# Altium project jetson-nano-baseboard.PrjPcb
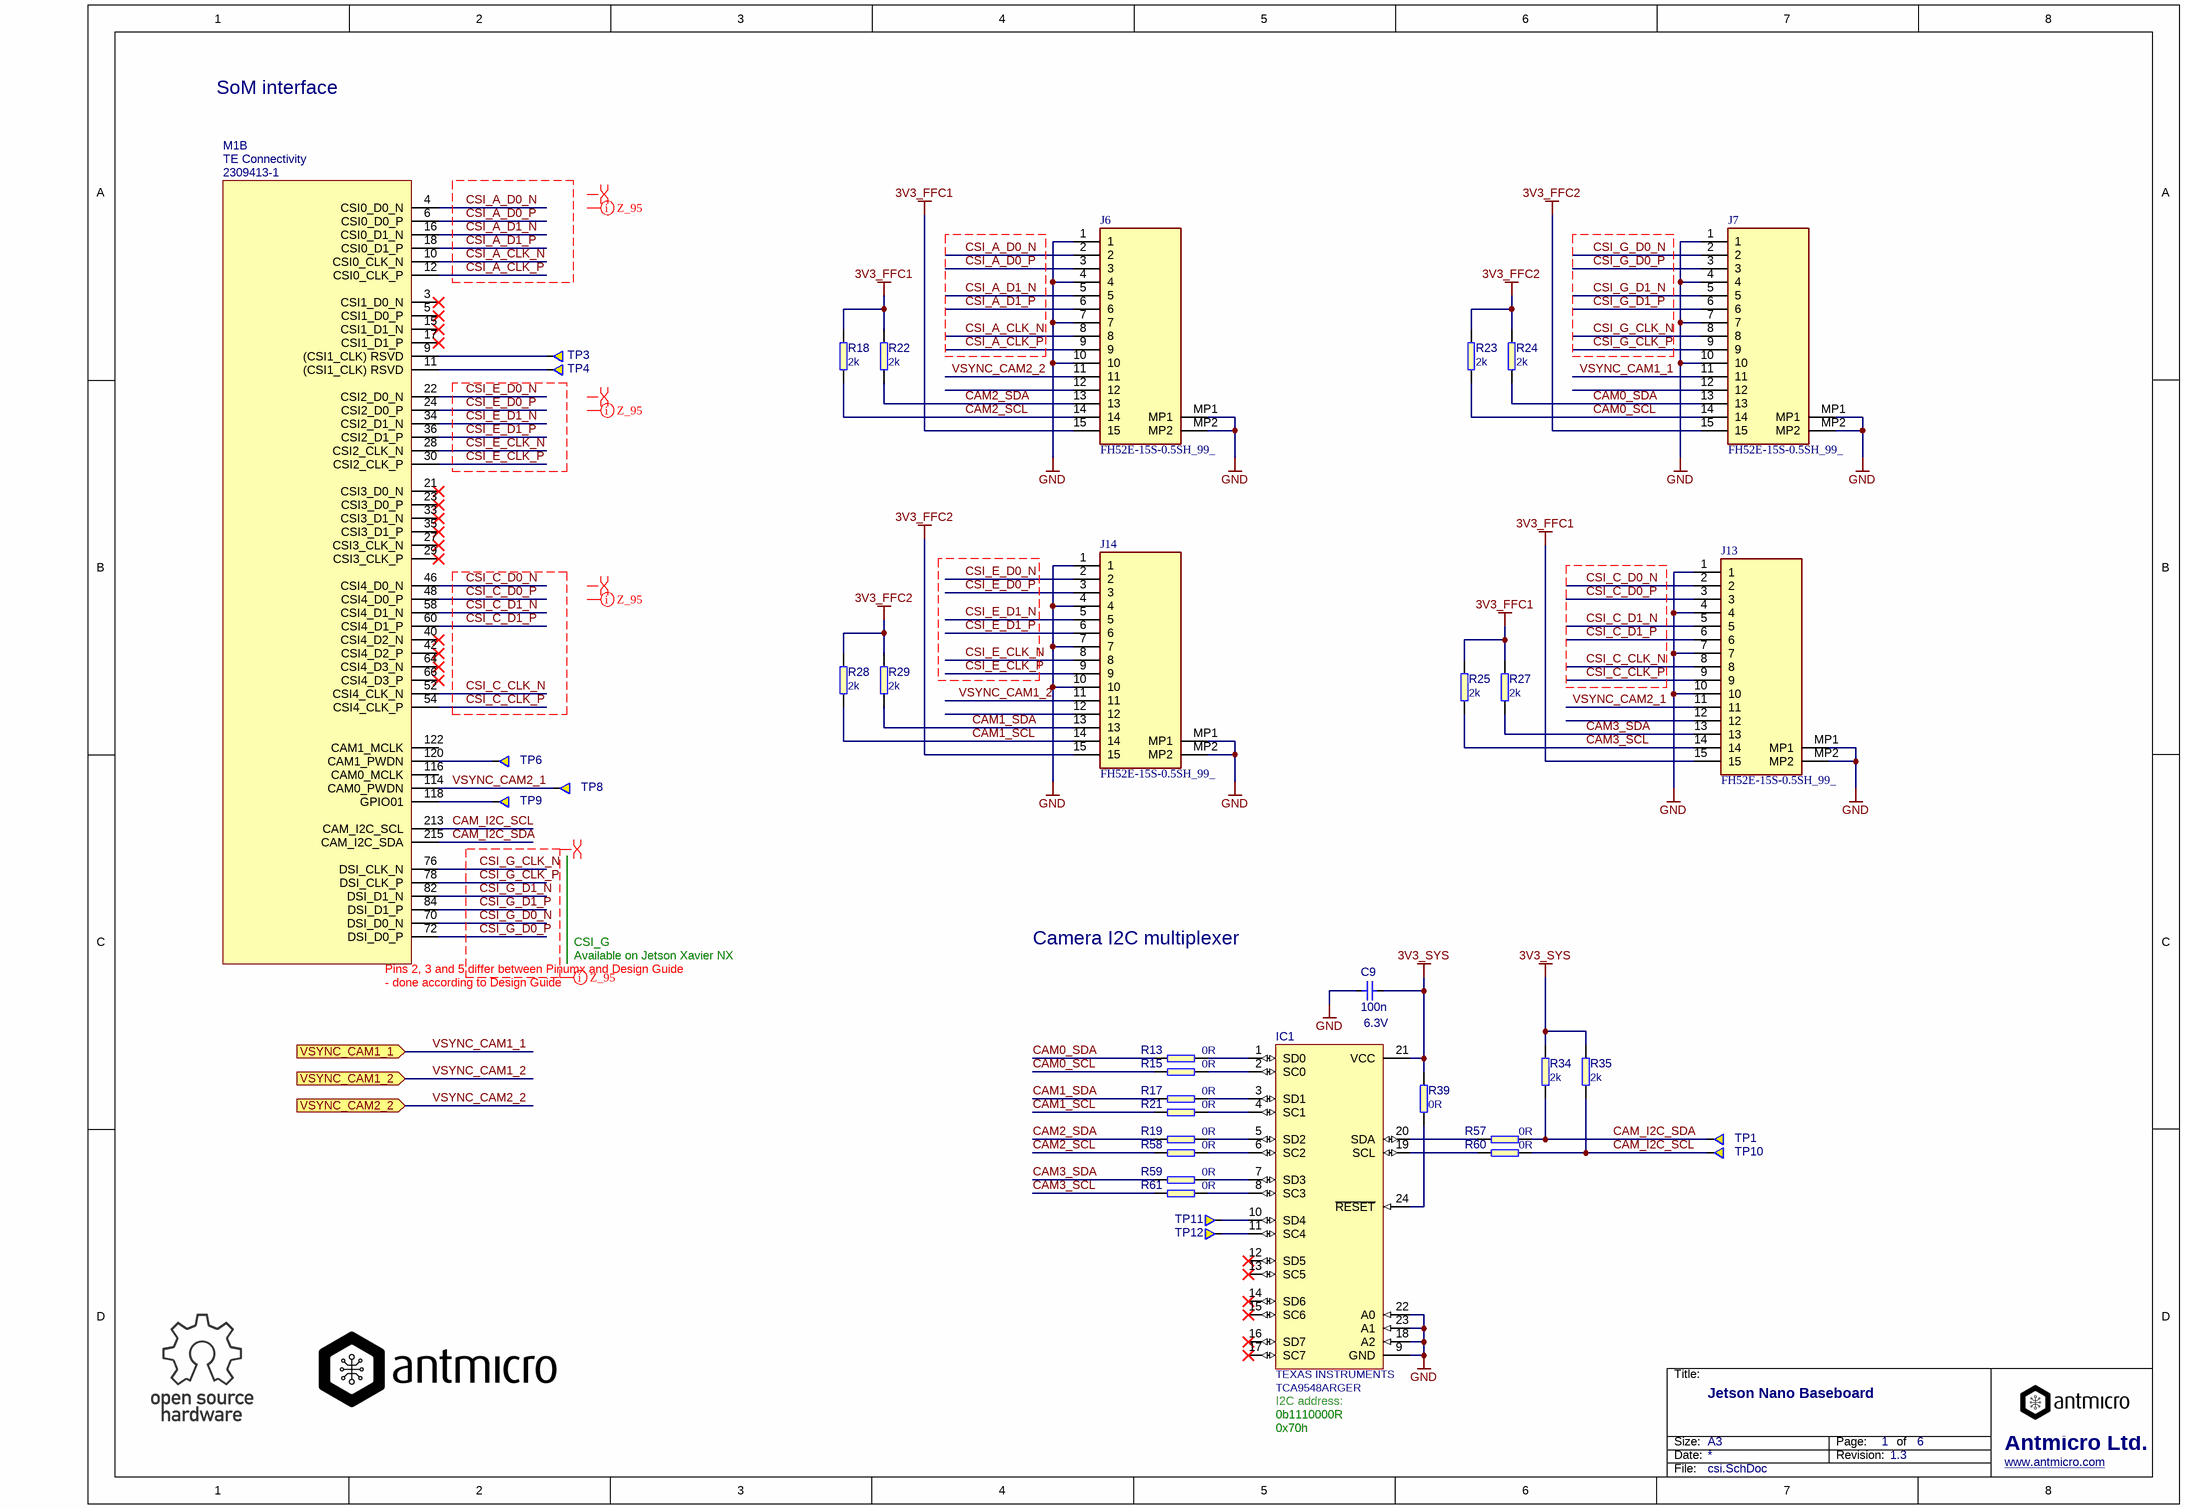
[diagram p0: csi.SchDoc]
AM_Revision: 1.3; AM_Status: OSHW; AM_Title: Jetson Nano Baseboard
3 sheets, 184 parts. Net scope: flat (ports and power ports of the same name join across sheets).
Board file: jetson-nano-0928-12.PcbDoc
Sheets:
  csi.SchDoc
  display.SchDoc
  supply.SchDoc

## Sheet csi.SchDoc
size A3; DocumentNumber: 1; SheetNumber: 1; SheetTotal: 6; PageSetup: Record=PageOptions|CenterHorizontal=True|CenterVertical=True|PrintScale=0.97|XCorrection=1.00|YCorrection=1.00|PrintKind=1|BorderSize=5000000|LeftOffset=0|BottomOffset=0|Orientation=2|PaperLength=2970|PaperWidth=2100|Scale=100|PaperSource=7|PrintQuality=600|MediaType=1|DitherType=10|PaperKind=A4|PrintScaleMode=1

### Parts
(Parts that share a designator on the sheet are numbered #1, #2 ... from top to bottom, then left to right.)
C9  Voltage: 6.3V  [0402]  (hidden comment: 100n)
IC1  TCA9548ARGER  Manufacturer: TEXAS INSTRUMENTS  [VQFN-24]
J6  FH52E-15S-0.5SH_99_  [FH52E15S05SH99]
J7  FH52E-15S-0.5SH_99_  [FH52E15S05SH99]
J13  FH52E-15S-0.5SH_99_  [FH52E15S05SH99]
J14  FH52E-15S-0.5SH_99_  [FH52E15S05SH99]
M1#1  Manufacturer: TE Connectivity  [jetson-nano-connector]  (hidden comment: 2309413-1)  (part B of 7)
R13  0R  [0402]
R15  0R  [0402]
R17  0R  [0402]
R18  2k  [0402]
R19  0R  [0402]
R21  0R  [0402]
R22  2k  [0402]
R23  2k  [0402]
R24  2k  [0402]
R25  2k  [0402]
R27  2k  [0402]
R28  2k  [0402]
R29  2k  [0402]
R34  2k  [0402]
R35  2k  [0402]
R39  0R  [0402]
R57  0R  [0402]
R58  0R  [0402]
R59  0R  [0402]
R60  0R  [0402]
R61  0R  [0402]
TP1  Testpad  [TP-R-1.5]  (value not drawn)  (no BOM)
TP3  Testpad  [TP-R-1.5]  (value not drawn)  (no BOM)
TP4  Testpad  [TP-R-1.5]  (value not drawn)  (no BOM)
TP6  Testpad  [TP-R-1.5]  (value not drawn)  (no BOM)
TP8  Testpad  [TP-R-1.5]  (value not drawn)  (no BOM)
TP9  Testpad  [TP-R-1.5]  (value not drawn)  (no BOM)
TP10  Testpad  [TP-R-1.5]  (value not drawn)  (no BOM)
TP11  Testpad  [TP-R-1.5]  (value not drawn)  (no BOM)
TP12  Testpad  [TP-R-1.5]  (value not drawn)  (no BOM)

### Ports
VSYNC_CAM1_1 (in), VSYNC_CAM1_2 (in), VSYNC_CAM2_2 (in)

### Nets
3V3_FFC1: J6.15 J13.15 R18.1 R22.1 R25.1 R27.1
3V3_FFC2: J7.15 J14.15 R23.1 R24.1 R28.1 R29.1
3V3_SYS: C9.2 IC1.21(VCC) R34.1 R35.1 R39.2
GND: C9.1 IC1.9(GND) IC1.18(A2) IC1.22(A0) IC1.23(A1) J6.1 J6.4 J6.7 J6.10 J6.MP1 J6.MP2 J7.1 J7.4 J7.7 J7.10 J7.MP1 J7.MP2 J13.1 J13.4 J13.7 J13.10 J13.MP1 J13.MP2 J14.1 J14.4 J14.7 J14.10 J14.MP1 J14.MP2
CAM0_SCL: J7.14 R15.1 R23.2
CAM0_SDA: J7.13 R13.1 R24.2
CAM1_SCL: J14.14 R21.1 R28.2
CAM1_SDA: J14.13 R17.1 R29.2
CAM2_SCL: J6.14 R18.2 R58.1
CAM2_SDA: J6.13 R19.1 R22.2
CAM3_SCL: J13.14 R25.2 R61.1
CAM3_SDA: J13.13 R27.2 R59.1
CAM_I2C_SCL: M1#1.213(CAM_I2C_SCL) R35.2 R60.2 TP10.1
CAM_I2C_SDA: M1#1.215(CAM_I2C_SDA) R34.2 R57.2 TP1.1
CSI_A_CLK_N: J6.8 M1#1.10(CSI0_CLK_N)
CSI_A_CLK_P: J6.9 M1#1.12(CSI0_CLK_P)
CSI_A_D0_N: J6.2 M1#1.4(CSI0_D0_N)
CSI_A_D0_P: J6.3 M1#1.6(CSI0_D0_P)
CSI_A_D1_N: J6.5 M1#1.16(CSI0_D1_N)
CSI_A_D1_P: J6.6 M1#1.18(CSI0_D1_P)
CSI_C_CLK_N: J13.8 M1#1.52(CSI4_CLK_N)
CSI_C_CLK_P: J13.9 M1#1.54(CSI4_CLK_P)
CSI_C_D0_N: J13.2 M1#1.46(CSI4_D0_N)
CSI_C_D0_P: J13.3 M1#1.48(CSI4_D0_P)
CSI_C_D1_N: J13.5 M1#1.58(CSI4_D1_N)
CSI_C_D1_P: J13.6 M1#1.60(CSI4_D1_P)
CSI_E_CLK_N: J14.8 M1#1.28(CSI2_CLK_N)
CSI_E_CLK_P: J14.9 M1#1.30(CSI2_CLK_P)
CSI_E_D0_N: J14.2 M1#1.22(CSI2_D0_N)
CSI_E_D0_P: J14.3 M1#1.24(CSI2_D0_P)
CSI_E_D1_N: J14.5 M1#1.34(CSI2_D1_N)
CSI_E_D1_P: J14.6 M1#1.36(CSI2_D1_P)
CSI_G_CLK_N: J7.8 M1#1.76(DSI_CLK_N)
CSI_G_CLK_P: J7.9 M1#1.78(DSI_CLK_P)
CSI_G_D0_N: J7.2 M1#1.70(DSI_D0_N)
CSI_G_D0_P: J7.3 M1#1.72(DSI_D0_P)
CSI_G_D1_N: J7.5 M1#1.82(DSI_D1_N)
CSI_G_D1_P: J7.6 M1#1.84(DSI_D1_P)
VSYNC_CAM1_1: J7.11 ; port VSYNC_CAM1_1
VSYNC_CAM1_2: J14.11 ; port VSYNC_CAM1_2
VSYNC_CAM2_1: J13.11 M1#1.114(CAM0_PWDN) TP8.1
VSYNC_CAM2_2: J6.11 ; port VSYNC_CAM2_2
NetIC1_1: IC1.1(SD0) R13.2
NetIC1_2: IC1.2(SC0) R15.2
NetIC1_3: IC1.3(SD1) R17.2
NetIC1_4: IC1.4(SC1) R21.2
NetIC1_5: IC1.5(SD2) R19.2
NetIC1_6: IC1.6(SC2) R58.2
NetIC1_7: IC1.7(SD3) R59.2
NetIC1_8: IC1.8(SC3) R61.2
NetIC1_10: IC1.10(SD4) TP11.1
NetIC1_11: IC1.11(SC4) TP12.1
NetIC1_19: IC1.19(SCL) R60.1
NetIC1_20: IC1.20(SDA) R57.1
NetIC1_24: IC1.24(~{RESET}) R39.1
NetM1#1_9: M1#1.9((CSI1_CLK)_RSVD) TP3.1
NetM1#1_11: M1#1.11((CSI1_CLK)_RSVD) TP4.1
NetM1#1_118: M1#1.118(GPIO01) TP9.1
NetM1#1_120: M1#1.120(CAM1_PWDN) TP6.1

Not connected (* = marked no-connect by the designer): IC1 12(SD5)* 13(SC5)* 14(SD6)* 15(SC6)* 16(SD7)* 17(SC7)*; J6 12; J7 12; J13 12; J14 12; M1#1 3(CSI1_D0_N)* 5(CSI1_D0_P)* 15(CSI1_D1_N)* 17(CSI1_D1_P)* 21(CSI3_D0_N)* 23(CSI3_D0_P)* 27(CSI3_CLK_N)* 29(CSI3_CLK_P)* 33(CSI3_D1_N)* 35(CSI3_D1_P)* 40(CSI4_D2_N)* 42(CSI4_D2_P)* 64(CSI4_D3_N)* 66(CSI4_D3_P)* 116(CAM0_MCLK) 122(CAM1_MCLK)

### Layout directives
differential pair: (no net found under the mark), CSI_G_CLK_N, CSI_G_CLK_P, CSI_G_D0_N, CSI_G_D0_P, CSI_G_D1_N, CSI_G_D1_P
net class Z_95: (no net found under the mark), CSI_G_CLK_N, CSI_G_CLK_P, CSI_G_D0_N, CSI_G_D0_P, CSI_G_D1_N, CSI_G_D1_P

### Notes on the sheet
- SoM interface
- CSI_G
- Available on Jetson Xavier NX
- Camera I2C multiplexer
- 0x70h
- 0b1110000R
- (near IC1) I2C address:
- Title:
- Size:
- Date:
- A3
- Revision:
- Page:
- of
- Antmicro Ltd.
- File:
- www.antmicro.com
- (in symbol jetson-nano-new-release, part B) Pins 2, 3 and 5 differ between Pinumx and Design Guide; - done according to Design Guide

### Library data of the parts
C9 = C_100n_0402: MLCC SMT Capacitor 100n 0402; Manufacturer: TDK; PartSymbol: C1005X5R0J104K050BA; Value: 100n; PartNumber: C_100n_0402
IC1 = TCA9548A: TCA9548ARGER  I2C SWITCH W/ RESET, 8-CH, VQFN-24; Value: TCA9548ARGER; PartNumber: TCA9548ARGER; PartSymbol: TCA9548ARGER
J6 J7 J13 J14 = FH52E-15S-0.5SH_99_: Connector; Manufacturer_Name: Hirose; Manufacturer_Part_Number: FH52E-15S-0.5SH(99); Description: FFC & FPC Connectors 0.5MM 15P LNG MTL FITNG SMT VERT MNT; Datasheet Link: https://componentsearchengine.com/Datasheets/1/FH52E-15S-0.5SH(99).pdf; Height: 2.2mm
M1#1 = jetson-nano-new-release: PartNumber: 2309413-1; PartSymbol: 2309413-1; Value: 2309413-1
R13 R15 R17 R19 R21 R39 R57-R61 = R_0R_0402: RES, 0R, 0402; Manufacturer: Panasonic; PartSymbol: ERJ2GE0R00X; Value: 0R; PartNumber: R_0R_0402
R18 R22-R25 R27-R29 R34 R35 = R_2k_0402: RES, 2k, 0402; Manufacturer: VISHAY; PartSymbol: CRCW04022K00FKED; PartNumber: R_2k_0402; Value: 2k
TP1 TP3 TP4 TP6 TP8-TP12 = Testpad: Testpad, round, 1.5mm; PartNumber: TP-R-1.5

## Sheet display.SchDoc
size A3; DocumentNumber: 2; SheetNumber: 2; SheetTotal: 6; PageSetup: Record=PageOptions|CenterHorizontal=True|CenterVertical=True|PrintScale=0.97|XCorrection=1.00|YCorrection=1.00|PrintKind=1|BorderSize=5000000|LeftOffset=0|BottomOffset=0|Orientation=2|PaperLength=2970|PaperWidth=2100|Scale=100|PaperSource=7|PrintQuality=600|MediaType=1|DitherType=10|PaperKind=A4|PrintScaleMode=1
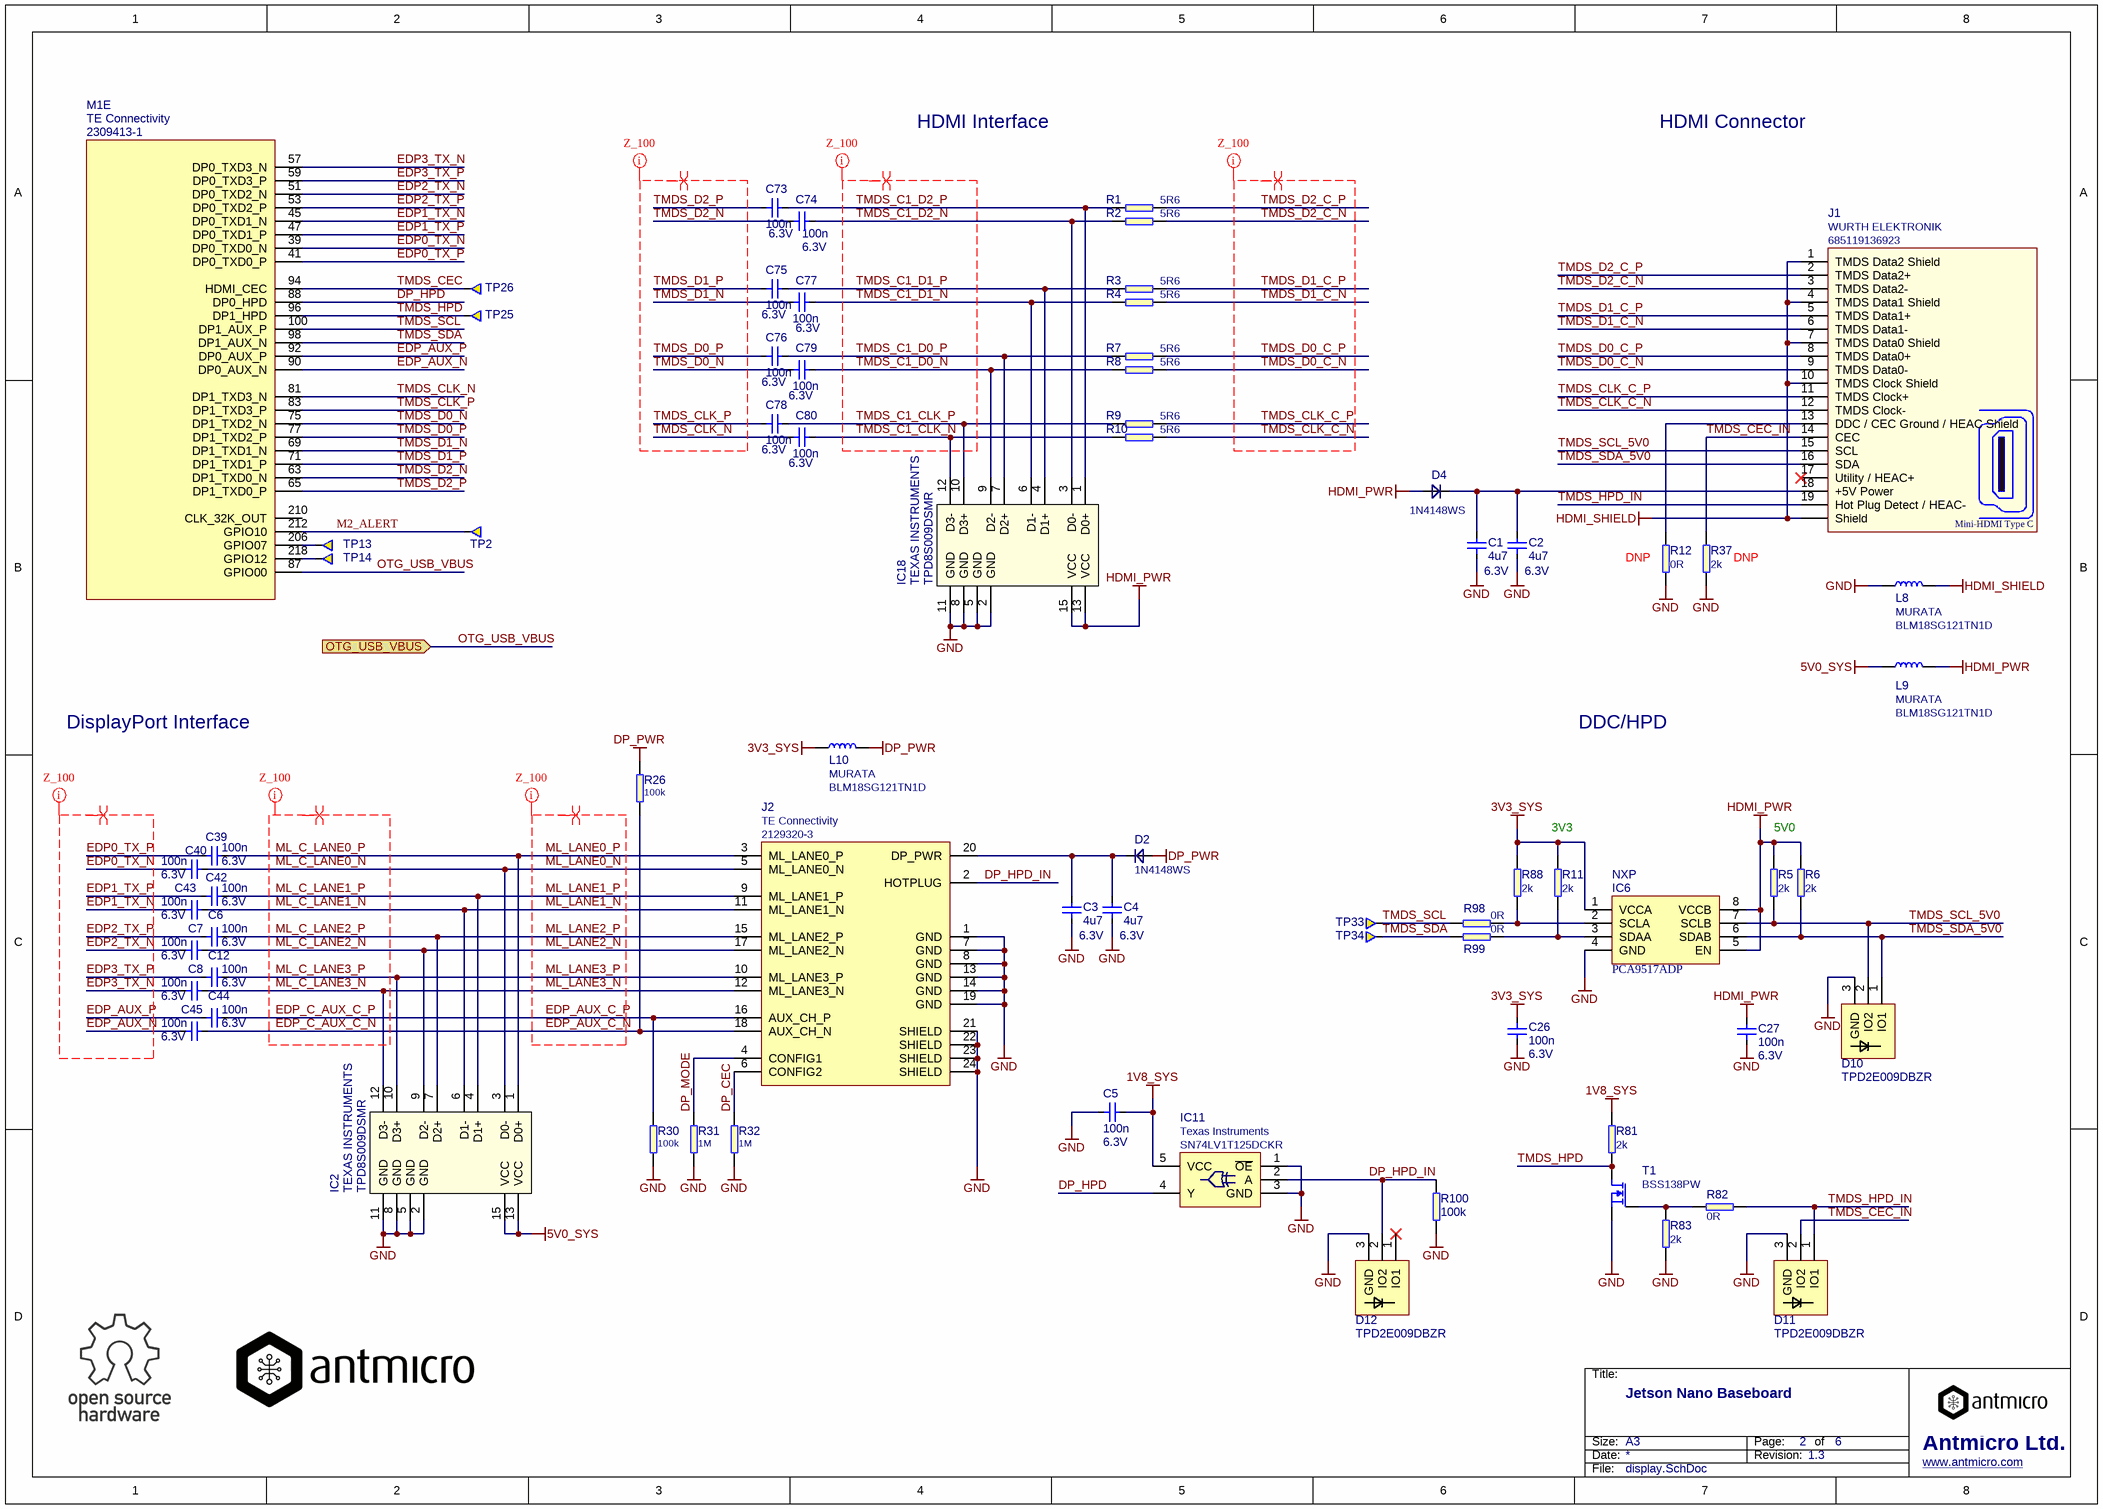
[diagram p1: display.SchDoc]

### Parts
(Parts that share a designator on the sheet are numbered #1, #2 ... from top to bottom, then left to right.)
C1  Voltage: 6.3V  [0402]  (hidden comment: 4u7)
C2  Voltage: 6.3V  [0402]  (hidden comment: 4u7)
C3  Voltage: 6.3V  [0402]  (hidden comment: 4u7)
C4  Voltage: 6.3V  [0402]  (hidden comment: 4u7)
C5  Voltage: 6.3V  [0402]  (hidden comment: 100n)
C6  Voltage: 6.3V  [0402]  (hidden comment: 100n)
C7  Voltage: 6.3V  [0402]  (hidden comment: 100n)
C8  Voltage: 6.3V  [0402]  (hidden comment: 100n)
C12  Voltage: 6.3V  [0402]  (hidden comment: 100n)
C26  Voltage: 6.3V  [0402]  (hidden comment: 100n)
C27  Voltage: 6.3V  [0402]  (hidden comment: 100n)
C39  Voltage: 6.3V  [0402]  (hidden comment: 100n)
C40  Voltage: 6.3V  [0402]  (hidden comment: 100n)
C42  Voltage: 6.3V  [0402]  (hidden comment: 100n)
C43  Voltage: 6.3V  [0402]  (hidden comment: 100n)
C44  Voltage: 6.3V  [0402]  (hidden comment: 100n)
C45  Voltage: 6.3V  [0402]  (hidden comment: 100n)
C73  Voltage: 6.3V  [0402]  (hidden comment: 100n)
C74  Voltage: 6.3V  [0402]  (hidden comment: 100n)
C75  Voltage: 6.3V  [0402]  (hidden comment: 100n)
C76  Voltage: 6.3V  [0402]  (hidden comment: 100n)
C77  Voltage: 6.3V  [0402]  (hidden comment: 100n)
C78  Voltage: 6.3V  [0402]  (hidden comment: 100n)
C79  Voltage: 6.3V  [0402]  (hidden comment: 100n)
C80  Voltage: 6.3V  [0402]  (hidden comment: 100n)
D2  1N4148WS  [SOD-323]
D4  1N4148WS  [SOD-323]
D10  TPD2E009DBZR  [SOT-23s]
D11  TPD2E009DBZR  [SOT-23s]
D12  TPD2E009DBZR  [SOT-23s]
IC2  Manufacturer: TEXAS INSTRUMENTS  PartSymbol: TPD8S009DSMR  [SON-15]  (hidden comment: TPD8S009)
IC6  PCA9517ADP  [MSOP-8]
IC11  SN74LV1T125DCKR  Manufacturer: Texas Instruments  [SC70-5]
IC18  Manufacturer: TEXAS INSTRUMENTS  PartSymbol: TPD8S009DSMR  [SON-15]  (hidden comment: TPD8S009)
J1  685119136923  Manufacturer: WURTH ELEKTRONIK  [WE_685119136923]
J2  2129320-3  Manufacturer: TE Connectivity  [2129320-3]
L8  BLM18SG121TN1D  Manufacturer: MURATA  [0603]
L9  BLM18SG121TN1D  Manufacturer: MURATA  [0603]
L10  BLM18SG121TN1D  Manufacturer: MURATA  [0603]
M1#2  Manufacturer: TE Connectivity  [jetson-nano-connector]  (hidden comment: 2309413-1)  (part E of 7)
R1  5R6  [0402]
R2  5R6  [0402]
R3  5R6  [0402]
R4  5R6  [0402]
R5  2k  [0402]
R6  2k  [0402]
R7  5R6  [0402]
R8  5R6  [0402]
R9  5R6  [0402]
R10  5R6  [0402]
R11  2k  [0402]
R12  0R  [0402]
R26  100k  [0402]
R30  100k  [0402]
R31  1M  [0402]
R32  1M  [0402]
R37  2k  [0402]
R81  2k  [0402]
R82  0R  [0402]
R83  2k  [0402]
R88  2k  [0402]
R98  0R  [0402]
R99  0R  [0402]
R100  100k  [0402]
T1  BSS138PW  [SC70-3]
TP2  Testpad  [TP-R-1.5]  (value not drawn)  (no BOM)
TP13  Testpad  [TP-R-1.5]  (value not drawn)  (no BOM)
TP14  Testpad  [TP-R-1.5]  (value not drawn)  (no BOM)
TP25  Testpad  [TP-R-1.5]  (value not drawn)  (no BOM)
TP26  Testpad  [TP-R-1.5]  (value not drawn)  (no BOM)
TP33  Testpad  [TP-R-1.5]  (value not drawn)  (no BOM)
TP34  Testpad  [TP-R-1.5]  (value not drawn)  (no BOM)

### Ports
OTG_USB_VBUS (in)

### Nets
1V8_SYS: C5.2 IC11.5(VCC) R81.1
3V3_SYS: C26.1 IC6.1(VCCA) L10.1 R11.1 R88.1
5V0_SYS: IC2.13(VCC) IC2.15(VCC) L9.1
DP_PWR: D2.A L10.2 R26.2
GND: C1.1 C2.1 C3.1 C4.1 C5.1 C26.2 C27.1 D10.3(GND) D11.3(GND) D12.3(GND) IC2.2(GND) IC2.5(GND) IC2.8(GND) IC2.11(GND) IC6.4(GND) IC11.1(~{OE}) IC11.3(GND) IC18.2(GND) IC18.5(GND) IC18.8(GND) IC18.11(GND) J2.1(GND) J2.7(GND) J2.8(GND) J2.13(GND) J2.14(GND) J2.19(GND) J2.21(SHIELD) J2.22(SHIELD) J2.23(SHIELD) J2.24(SHIELD) L8.1 R12.1 R30.1 R31.1 R32.1 R37.2 R83.2 R100.1 T1.2(S)
HDMI_PWR: C27.2 D4.A IC6.5(EN) IC6.8(VCCB) IC18.13(VCC) IC18.15(VCC) L9.2 R5.1 R6.1
HDMI_SHIELD: J1.1(TMDS_Data2_Shield) J1.4(TMDS_Data1_Shield) J1.7(TMDS_Data0_Shield) J1.10(TMDS_Clock_Shield) J1.Shell(Shield) L8.2
DP_CEC: J2.6(CONFIG2) R32.2
DP_HPD: IC11.4(Y) M1#2.88(DP0_HPD)
DP_HPD_IN: D12.2(IO2) IC11.2(A) J2.2(HOTPLUG) R100.2
DP_MODE: J2.4(CONFIG1) R31.2
EDP0_TX_N: C40.1 M1#2.39(DP0_TXD0_N)
EDP0_TX_P: C39.1 M1#2.41(DP0_TXD0_P)
EDP1_TX_N: C43.1 M1#2.45(DP0_TXD1_N)
EDP1_TX_P: C42.1 M1#2.47(DP0_TXD1_P)
EDP2_TX_N: C7.1 M1#2.51(DP0_TXD2_N)
EDP2_TX_P: C6.1 M1#2.53(DP0_TXD2_P)
EDP3_TX_N: C12.1 M1#2.57(DP0_TXD3_N)
EDP3_TX_P: C8.1 M1#2.59(DP0_TXD3_P)
EDP_AUX_C_N: C45.2 J2.18(AUX_CH_N) R26.1  [also labelled EDP_C_AUX_C_N]
EDP_AUX_C_P: C44.2 J2.16(AUX_CH_P) R30.2  [also labelled EDP_C_AUX_C_P]
EDP_AUX_N: C45.1 M1#2.90(DP0_AUX_N)
EDP_AUX_P: C44.1 M1#2.92(DP0_AUX_P)
M2_ALERT: M1#2.212(GPIO10) TP2.1
ML_C_LANE0_N: C40.2 IC2.3(D0-) J2.5(ML_LANE0_N)  [also labelled ML_LANE0_N]
ML_C_LANE0_P: C39.2 IC2.1(D0+) J2.3(ML_LANE0_P)  [also labelled ML_LANE0_P]
ML_C_LANE1_N: C43.2 IC2.6(D1-) J2.11(ML_LANE1_N)  [also labelled ML_LANE1_N]
ML_C_LANE1_P: C42.2 IC2.4(D1+) J2.9(ML_LANE1_P)  [also labelled ML_LANE1_P]
ML_C_LANE2_N: C7.2 IC2.9(D2-) J2.17(ML_LANE2_N)  [also labelled ML_LANE2_N]
ML_C_LANE2_P: C6.2 IC2.7(D2+) J2.15(ML_LANE2_P)  [also labelled ML_LANE2_P]
ML_C_LANE3_N: C12.2 IC2.12(D3-) J2.12(ML_LANE3_N)  [also labelled ML_LANE3_N]
ML_C_LANE3_P: C8.2 IC2.10(D3+) J2.10(ML_LANE3_P)  [also labelled ML_LANE3_P]
OTG_USB_VBUS: M1#2.87(GPIO00) ; port OTG_USB_VBUS
TMDS_C1_CLK_N: C80.2 IC18.12(D3-) R10.1
TMDS_C1_CLK_P: C78.2 IC18.10(D3+) R9.1
TMDS_C1_D0_N: C79.2 IC18.9(D2-) R8.1
TMDS_C1_D0_P: C76.2 IC18.7(D2+) R7.1
TMDS_C1_D1_N: C77.2 IC18.6(D1-) R4.1
TMDS_C1_D1_P: C75.2 IC18.4(D1+) R3.1
TMDS_C1_D2_N: C74.2 IC18.3(D0-) R2.1
TMDS_C1_D2_P: C73.2 IC18.1(D0+) R1.1
TMDS_CEC: M1#2.94(HDMI_CEC) TP26.1
TMDS_CEC_IN: D11.2(IO2) J1.14(CEC) R37.1
TMDS_CLK_C_N: J1.12(TMDS_Clock-) R10.2
TMDS_CLK_C_P: J1.11(TMDS_Clock+) R9.2
TMDS_CLK_N: C80.1 M1#2.81(DP1_TXD3_N)
TMDS_CLK_P: C78.1 M1#2.83(DP1_TXD3_P)
TMDS_D0_C_N: J1.9(TMDS_Data0-) R8.2
TMDS_D0_C_P: J1.8(TMDS_Data0+) R7.2
TMDS_D0_N: C79.1 M1#2.75(DP1_TXD2_N)
TMDS_D0_P: C76.1 M1#2.77(DP1_TXD2_P)
TMDS_D1_C_N: J1.6(TMDS_Data1-) R4.2
TMDS_D1_C_P: J1.5(TMDS_Data1+) R3.2
TMDS_D1_N: C77.1 M1#2.69(DP1_TXD1_N)
TMDS_D1_P: C75.1 M1#2.71(DP1_TXD1_P)
TMDS_D2_C_N: J1.3(TMDS_Data2-) R2.2
TMDS_D2_C_P: J1.2(TMDS_Data2+) R1.2
TMDS_D2_N: C74.1 M1#2.63(DP1_TXD0_N)
TMDS_D2_P: C73.1 M1#2.65(DP1_TXD0_P)
TMDS_HPD: M1#2.96(DP1_HPD) R81.2 T1.3(D) TP25.1
TMDS_HPD_IN: D11.1(IO1) J1.19(Hot_Plug_Detect_/_HEAC-) R82.1
TMDS_SCL: M1#2.100(DP1_AUX_P) R98.2 TP33.1
TMDS_SCL_5V0: D10.2(IO2) IC6.7(SCLB) J1.15(SCL) R5.2
TMDS_SDA: M1#2.98(DP1_AUX_N) R99.2 TP34.1
TMDS_SDA_5V0: D10.1(IO1) IC6.6(SDAB) J1.16(SDA) R6.2
NetC1_2: C1.2 C2.2 D4.C J1.18(+5V_Power)
NetC3_2: C3.2 C4.2 D2.C J2.20(DP_PWR)
NetIC6_2: IC6.2(SCLA) R88.2 R98.1
NetIC6_3: IC6.3(SDAA) R11.2 R99.1
NetJ1_13: J1.13(DDC_/_CEC_Ground_/_HEAC_Shield) R12.2
NetM1#2_206: M1#2.206(GPIO07) TP13.1
NetM1#2_218: M1#2.218(GPIO12) TP14.1
NetR82_2: R82.2 R83.1 T1.1(G)

Not connected (* = marked no-connect by the designer): D12 1(IO1)*; J1 17(Utility_/_HEAC+)*; M1#2 210(CLK_32K_OUT)

### Layout directives
differential pair: EDP0_TX_N, EDP0_TX_P, EDP1_TX_N, EDP1_TX_P, EDP2_TX_N, EDP2_TX_P, EDP3_TX_N, EDP3_TX_P, EDP_AUX_C_N, EDP_AUX_C_P, EDP_AUX_N, EDP_AUX_P, EDP_C_AUX_C_N, EDP_C_AUX_C_P, ML_C_LANE0_N, ML_C_LANE0_P, ML_C_LANE1_N, ML_C_LANE1_P, ML_C_LANE2_N, ML_C_LANE2_P, ML_C_LANE3_N, ML_C_LANE3_P, ML_LANE0_N, ML_LANE0_P, ML_LANE1_N, ML_LANE1_P, ML_LANE2_N, ML_LANE2_P, ML_LANE3_N, ML_LANE3_P, TMDS_C1_CLK_N, TMDS_C1_CLK_P, TMDS_C1_D0_N, TMDS_C1_D0_P, TMDS_C1_D1_N, TMDS_C1_D1_P, TMDS_C1_D2_N, TMDS_C1_D2_P, TMDS_CLK_C_N, TMDS_CLK_C_P, TMDS_CLK_N, TMDS_CLK_P, TMDS_D0_C_N, TMDS_D0_C_P, TMDS_D0_N, TMDS_D0_P, TMDS_D1_C_N, TMDS_D1_C_P, TMDS_D1_N, TMDS_D1_P, TMDS_D2_C_N, TMDS_D2_C_P, TMDS_D2_N, TMDS_D2_P
net class Z_100: EDP0_TX_N, EDP0_TX_P, EDP1_TX_N, EDP1_TX_P, EDP2_TX_N, EDP2_TX_P, EDP3_TX_N, EDP3_TX_P, EDP_AUX_C_N, EDP_AUX_C_P, EDP_AUX_N, EDP_AUX_P, EDP_C_AUX_C_N, EDP_C_AUX_C_P, ML_C_LANE0_N, ML_C_LANE0_P, ML_C_LANE1_N, ML_C_LANE1_P, ML_C_LANE2_N, ML_C_LANE2_P, ML_C_LANE3_N, ML_C_LANE3_P, ML_LANE0_N, ML_LANE0_P, ML_LANE1_N, ML_LANE1_P, ML_LANE2_N, ML_LANE2_P, ML_LANE3_N, ML_LANE3_P, TMDS_C1_CLK_N, TMDS_C1_CLK_P, TMDS_C1_D0_N, TMDS_C1_D0_P, TMDS_C1_D1_N, TMDS_C1_D1_P, TMDS_C1_D2_N, TMDS_C1_D2_P, TMDS_CLK_C_N, TMDS_CLK_C_P, TMDS_CLK_N, TMDS_CLK_P, TMDS_D0_C_N, TMDS_D0_C_P, TMDS_D0_N, TMDS_D0_P, TMDS_D1_C_N, TMDS_D1_C_P, TMDS_D1_N, TMDS_D1_P, TMDS_D2_C_N, TMDS_D2_C_P, TMDS_D2_N, TMDS_D2_P

### Notes on the sheet
- HDMI Interface
- HDMI Connector
- 1V8
- (near R12) DNP
- (near R37) DNP
- DisplayPort Interface
- DDC/HPD
- 3V3
- 5V0
- (near IC6) NXP
- Title:
- Size:
- Date:
- A3
- Revision:
- Page:
- of
- Antmicro Ltd.
- File:
- www.antmicro.com
- (in symbol WE_685119136923) Mini-HDMI Type C

### Library data of the parts
C1-C4 = C_4u7_0402: MLCC SMT Capacitor 4.7uF 0402; Manufacturer: MURATA; PartSymbol: GRM155R60J475ME87D; PartNumber: C_4u7_0402; Value: 4u7
C5-C8 C12 C26 C27 C39 C40 C42-C45 C73-C80 = C_100n_0402: as C9 on sheet csi; Value: 100n; PartNumber: C_100n_0402
D2 D4 = diode: Diode small signal; Manufacturer: ON SEMICONDUCTOR; Value: 1N4148WS; PartNumber: 1N4148WS; PartSymbol: 1N4148WS
D10-D12 = TPD2E009DBZR: DIODE, SCHOTTKY, 30V, 200MA, SOT-23; Manufacturer: NXP; PartNumber: TPD2E009DBZR; Value: TPD2E009DBZR; MPN: TPD2E009DBZR
IC2 IC18 = TPD8S009: 8-Channel ESD Protection for DisplayPort and HDMI; Value: TPD8S009; PartNumber: TPD8S009
IC6 = PCA9517ADP: IC REDRIVER I2C 1CH 8TSSOP; Manufacturer: NXP; Value: PCA9517ADP; PartNumber: PCA9517ADP; PartSymbol: PCA9517ADP
IC11 = SN74LV1T125: Buffer, 74LV1T125, 1.6 V to 5.5 V, SOT-23-5; PartNumber: SN74LV1T125DCKR; Value: SN74LV1T125DCKR; PartSymbol: SN74LV1T125DCKR
J1 = WE_685119136923: CONN HDMI FEMALE R/A 19POS 2.6MM; PartNumber: WE_685119136923; Value: 685119136923; PartSymbol: WE_685119136923
J2 = miniDP: Mini Displayport Reverse Offset; PartNumber: 2129320-3; Value: 2129320-3; PartSymbol: 2129320-3
L8-L10 = BLM18SG121TN1D: FERRITE BEAD, 0.025OHM, 3A, 0603; Value: BLM18SG121TN1D; PartNumber: BLM18SG121TN1D; PartSymbol: BLM18SG121TN1D
M1#2 = jetson-nano-new-release: PartNumber: 2309413-1; PartSymbol: 2309413-1; Value: 2309413-1
R1-R4 R7-R10 = R_5R6_0402: RES, 5R6, 0402; Manufacturer: Panasonic; PartSymbol: ERJ2GEJ5R6X; PartNumber: R_5R6_0402; Value: 5R6
R5 R6 R11 R37 R81 R83 R88 = R_2k_0402: as R18 on sheet csi; PartNumber: R_2k_0402; Value: 2k
R12 R82 R98 R99 = R_0R_0402: as R13 on sheet csi; PartNumber: R_0R_0402; Value: 0R
R26 R30 R100 = R_100k_0402: SMT Resistor 100k 0402; Manufacturer: VISHAY; PartSymbol: CRCW0402100KFKEDHP; Tolerance: 1%; PartNumber: R_100k_0402; Value: 100k
R31 R32 = R_1M_0402: SMT Resistor 1M 0402; Manufacturer: VISHAY; PartSymbol: CRCW04021M00FKED; Tolerance: 1%; PartNumber: R_1M_0402; Value: 1M
T1 = NMOS: MOSFET, N CH, 60V, 0.2A; Manufacturer: NXP; Value: BSS138PW; PartNumber: BSS138PW; PartSymbol: BSS138PW
TP2 TP13 TP14 TP25 TP26 TP33 TP34 = Testpad: Testpad, round, 1.5mm; PartNumber: TP-R-1.5

## Sheet supply.SchDoc
size A3; DocumentNumber: 5; SheetNumber: 5; SheetTotal: 6; PageSetup: Record=PageOptions|CenterHorizontal=True|CenterVertical=True|PrintScale=0.97|XCorrection=1.00|YCorrection=1.00|PrintKind=1|BorderSize=5000000|LeftOffset=0|BottomOffset=0|Orientation=2|PaperLength=2970|PaperWidth=2100|Scale=100|PaperSource=7|PrintQuality=600|MediaType=1|DitherType=10|PaperKind=A4|PrintScaleMode=1
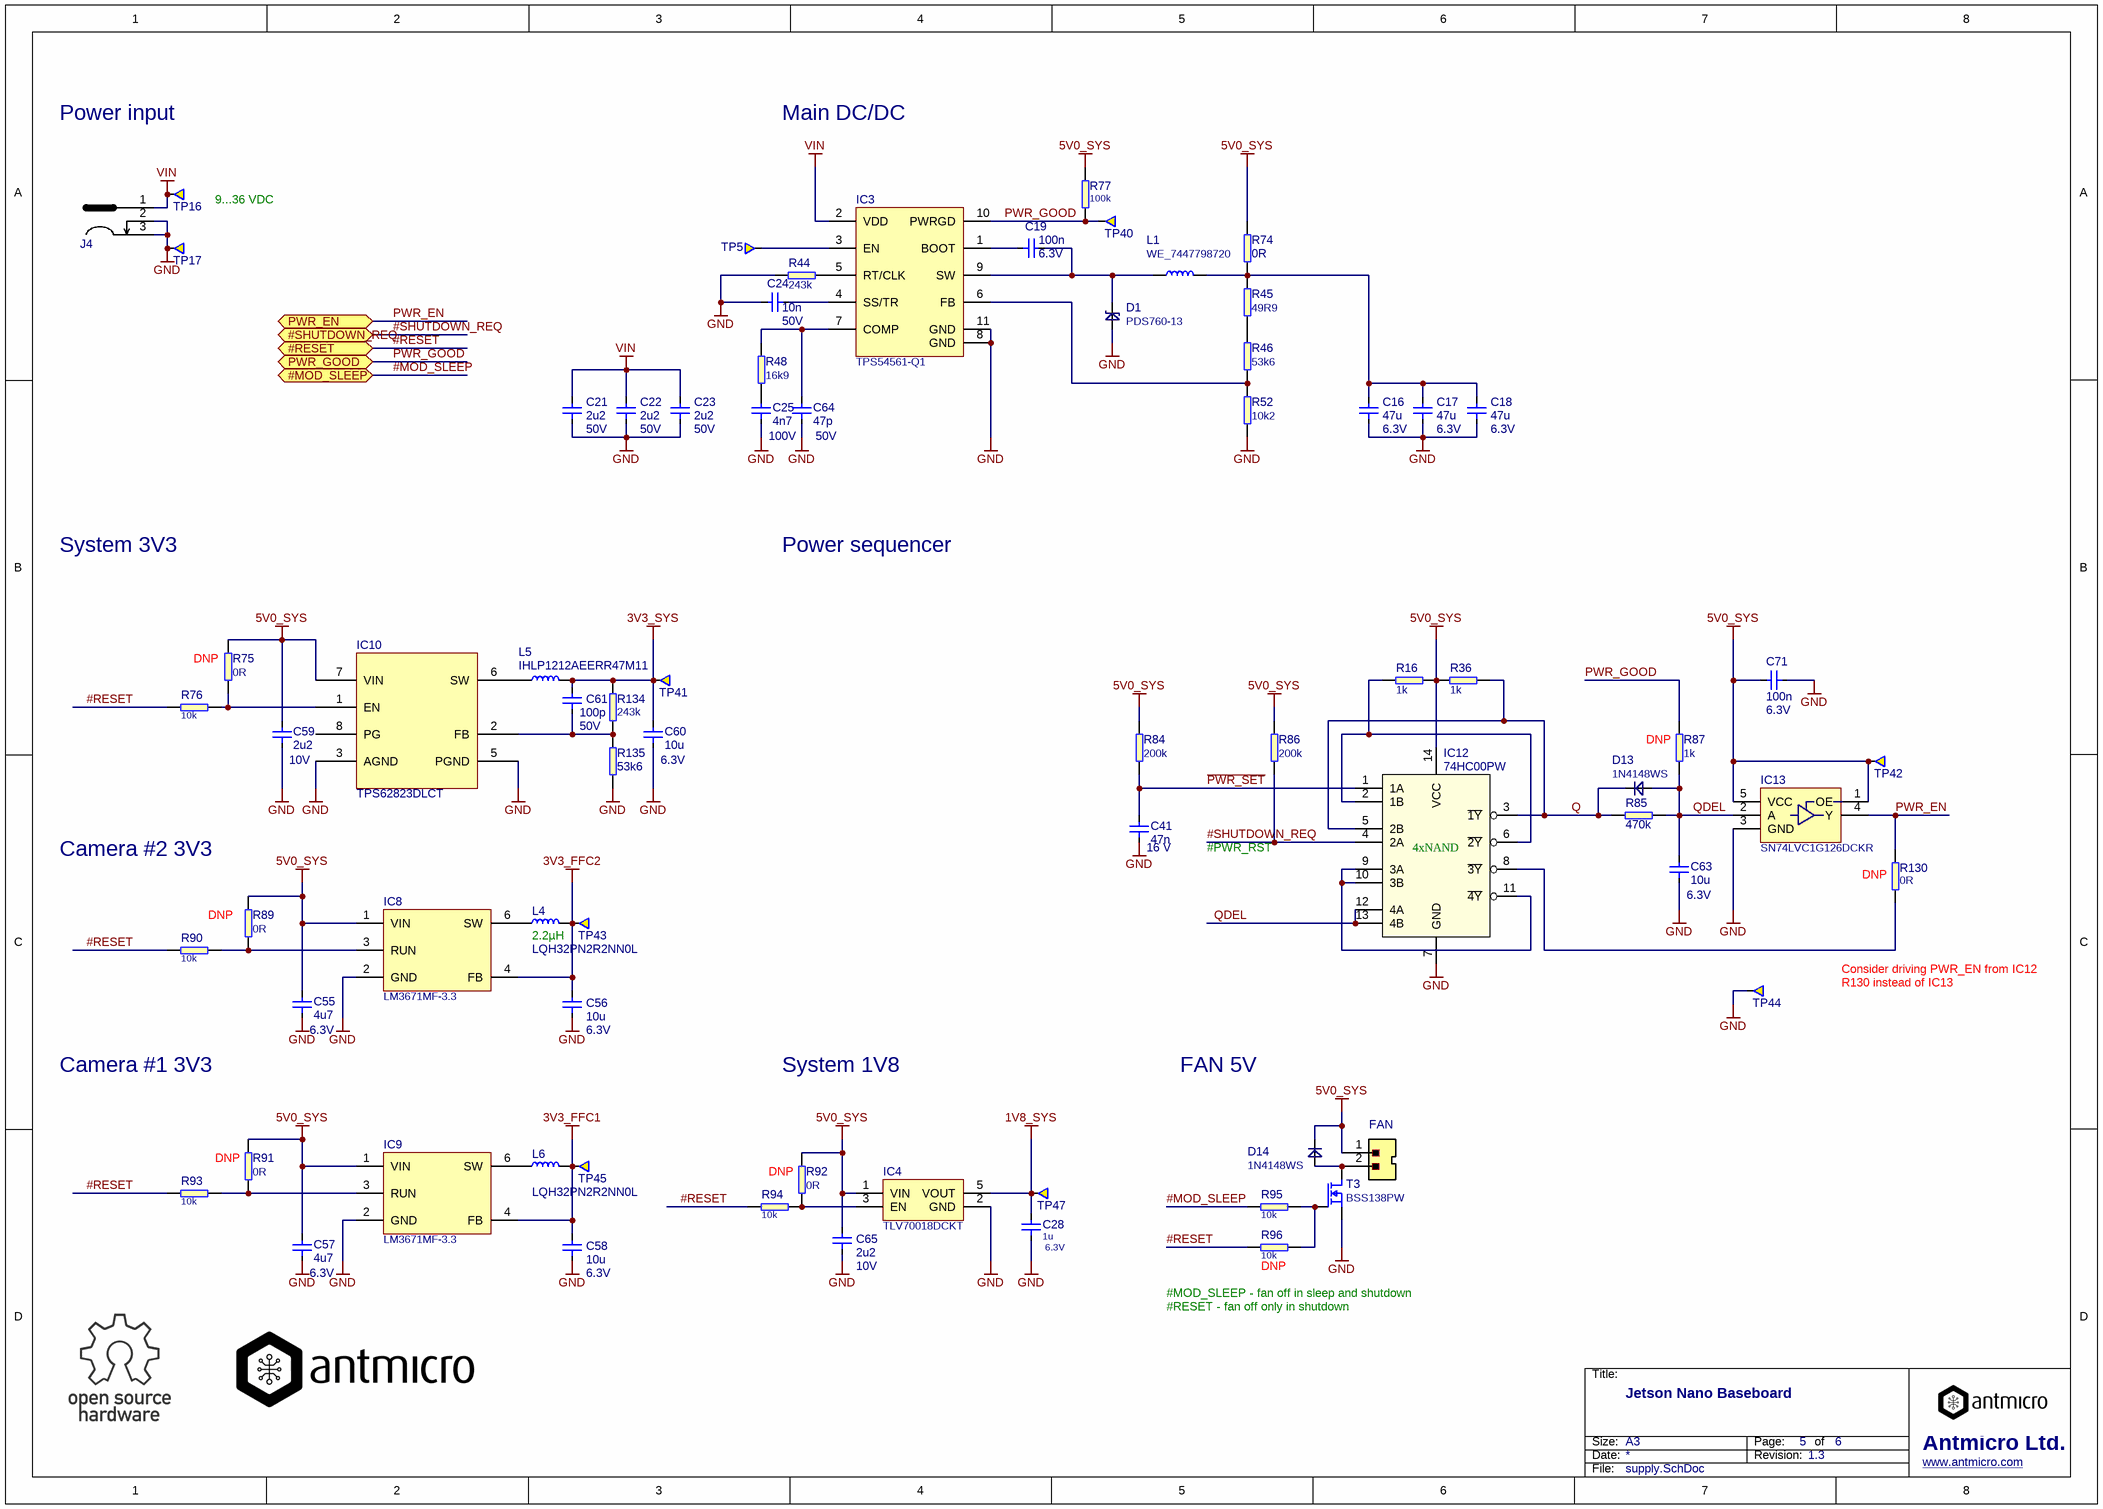
[diagram p2: supply.SchDoc]

### Parts
C16  Voltage: 6.3V  [0805]  (hidden comment: 47u)
C17  Voltage: 6.3V  [0805]  (hidden comment: 47u)
C18  Voltage: 6.3V  [0805]  (hidden comment: 47u)
C19  Voltage: 6.3V  [0402]  (hidden comment: 100n)
C21  Voltage: 50V  [1206]  (hidden comment: 2u2)
C22  Voltage: 50V  [1206]  (hidden comment: 2u2)
C23  Voltage: 50V  [1206]  (hidden comment: 2u2)
C24  Voltage: 50V  [0402]  (hidden comment: 10n)
C25  Voltage: 100V  [0402]  (hidden comment: 4n7)
C28  Voltage: 6.3V  [0402]  (hidden comment: 1u)
C41  Voltage: 16 V  [0402]  (hidden comment: 47n)
C55  Voltage: 6.3V  [0402]  (hidden comment: 4u7)
C56  Voltage: 6.3V  [0603]  (hidden comment: 10u)
C57  Voltage: 6.3V  [0402]  (hidden comment: 4u7)
C58  Voltage: 6.3V  [0603]  (hidden comment: 10u)
C59  Voltage: 10V  [0402]  (hidden comment: 2u2)
C60  Voltage: 6.3V  [0603]  (hidden comment: 10u)
C61  Voltage: 50V  [0402]  (hidden comment: 100p)
C63  Voltage: 6.3V  [0603]  (hidden comment: 10u)
C64  Voltage: 50V  [0402]  (hidden comment: 47p)
C65  Voltage: 10V  [0402]  (hidden comment: 2u2)
C71  Voltage: 6.3V  [0402]  (hidden comment: 100n)
D1  PDS760-13  [PowerDI]
D13  1N4148WS  [SOD-323]
D14  1N4148WS  [SOD-323]
FAN  MX-22-23-2021  [molex_2223-2021]  (value not drawn)
IC3  TPS54561-Q1  [WSON-10_4x4]
IC4  TLV70018DCKT  [SC70-5]
IC8  LM3671MF-3.3  [SOT23-5N]
IC9  LM3671MF-3.3  [SOT23-5N]
IC10  TPS62823DLCT  [TPS62823]
IC12  74HC00PW  [TSSOP-14]
IC13  SN74LVC1G126DCKR  [R-PDSO-G5]
J4  MJ-179PH  [DC_SOCKET]  (value not drawn)
L1  WE_7447798720  [WE_7447798720]
L4  LQH32PN2R2NN0L  [LQH32PN2R2NN0L]
L5  IHLP1212AEERR47M11  [IHLP-1212AE]
L6  LQH32PN2R2NN0L  [LQH32PN2R2NN0L]
R16  1k  [0402]
R36  1k  [0402]
R44  243k  [0402]
R45  49R9  [0402]
R46  53k6  [0402]
R48  16k9  [0402]
R52  10k2  [0402]
R74  0R  [0805]
R75  0R  [0402]
R76  10k  [0402]
R77  100k  [0402]
R84  200k  [0402]
R85  470k  [0402]
R86  200k  [0402]
R87  1k  [0402]
R89  0R  [0402]
R90  10k  [0402]
R91  0R  [0402]
R92  0R  [0402]
R93  10k  [0402]
R94  10k  [0402]
R95  10k  [0402]
R96  10k  [0402]
R130  0R  [0402]
R134  243k  [0402]
R135  53k6  [0402]
T3  BSS138PW  [SC70-3]
TP5  Testpad  [TP-R-1.5]  (value not drawn)  (no BOM)
TP16  Testpad  [TP-R-1.5]  (value not drawn)  (no BOM)
TP17  Testpad  [TP-R-1.5]  (value not drawn)  (no BOM)
TP40  Testpad  [TP-R-1.5]  (value not drawn)  (no BOM)
TP41  Testpad  [TP-R-1.5]  (value not drawn)  (no BOM)
TP42  Testpad  [TP-R-1.5]  (value not drawn)  (no BOM)
TP43  Testpad  [TP-R-1.5]  (value not drawn)  (no BOM)
TP44  Testpad  [TP-R-1.5]  (value not drawn)  (no BOM)
TP45  Testpad  [TP-R-1.5]  (value not drawn)  (no BOM)
TP47  Testpad  [TP-R-1.5]  (value not drawn)  (no BOM)

### Ports
#MOD_SLEEP, #RESET, #SHUTDOWN_REQ, PWR_EN, PWR_GOOD

### Nets
1V8_SYS: C28.2 IC4.5(VOUT) TP47.1
3V3_FFC1: C58.2 IC9.4(FB) L6.2 TP45.1
3V3_FFC2: C56.2 IC8.4(FB) L4.2 TP43.1
3V3_SYS: C60.2 C61.2 L5.2 R134.1 TP41.1
5V0_SYS: C55.2 C57.2 C59.2 C65.2 C71.2 D14.C FAN.1 IC4.1(VIN) IC8.1(VIN) IC9.1(VIN) IC10.7(VIN) IC12.14(VCC) IC13.1(OE) IC13.5(VCC) R16.1 R36.2 R74.2 R75.2 R77.2 R84.2 R86.2 R89.2 R91.2 R92.1 TP42.1
GND: C16.1 C17.1 C18.1 C21.1 C22.1 C23.1 C24.2 C25.1 C28.1 C41.1 C55.1 C56.1 C57.1 C58.1 C59.1 C60.1 C63.1 C64.1 C65.1 C71.1 D1.A IC3.8(GND) IC3.11(GND) IC4.2(GND) IC8.2(GND) IC9.2(GND) IC10.3(AGND) IC10.5(PGND) IC12.7(GND) IC13.3(GND) J4.2 J4.3 R44.2 R52.1 R135.1 T3.2(S) TP17.1 TP44.1
VIN: C21.2 C22.2 C23.2 IC3.2(VDD) J4.1 TP16.1
#MOD_SLEEP: R95.2 ; port #MOD_SLEEP
#RESET: R76.2 R90.2 R93.2 R94.2 R96.2 ; port #RESET
#SHUTDOWN_REQ: IC12.4(2A) R86.1 ; port #SHUTDOWN_REQ
~{PWR_SET}: C41.2 IC12.1(1A) R84.1
PWR_EN: IC13.4(Y) R130.1 ; port PWR_EN
PWR_GOOD: IC3.10(PWRGD) R77.1 R87.1 TP40.1 ; port PWR_GOOD
Q: D13.C IC12.3(~{1Y}) IC12.5(2B) R36.1 R85.1
QDEL: C63.2 D13.A IC12.12(4A) IC12.13(4B) IC13.2(A) R85.2 R87.2
NetC16_2: C16.2 C17.2 C18.2 L1.2 R45.2 R74.1
NetC19_1: C19.1 IC3.1(BOOT)
NetC19_2: C19.2 D1.C IC3.9(SW) L1.1
NetC24_1: C24.1 IC3.4(SS/TR)
NetC25_2: C25.2 R48.1
NetC61_1: C61.1 IC10.2(FB) R134.2 R135.2
NetC64_2: C64.2 IC3.7(COMP) R48.2
NetD14_A: D14.A FAN.2 T3.3(D)
NetIC3_3: IC3.3(EN) TP5.1
NetIC3_5: IC3.5(RT/CLK) R44.1
NetIC3_6: IC3.6(FB) R46.1 R52.2
NetIC4_3: IC4.3(EN) R92.2 R94.1
NetIC8_3: IC8.3(RUN) R89.1 R90.1
NetIC8_6: IC8.6(SW) L4.1
NetIC9_3: IC9.3(RUN) R91.1 R93.1
NetIC9_6: IC9.6(SW) L6.1
NetIC10_1: IC10.1(EN) R75.1 R76.1
NetIC10_6: IC10.6(SW) L5.1
NetIC12_2: IC12.2(1B) IC12.6(~{2Y}) R16.2
NetIC12_8: IC12.8(~{3Y}) R130.2
NetIC12_9: IC12.9(3A) IC12.10(3B) IC12.11(~{4Y})
NetR45_1: R45.1 R46.2
NetR95_1: R95.1 R96.1 T3.1(G)

Not connected (* = marked no-connect by the designer): IC10 8(PG)

### Notes on the sheet
- Power input
- Main DC/DC
- 9...36 VDC
- System 3V3
- Power sequencer
- (near R75) DNP
- (near R87) DNP
- Camera #2 3V3
- #PWR_RST
- DNP
- (near R130) DNP
- (near L4) 2.2µH
- R130 instead of IC13
- Consider driving PWR_EN from IC12
- Camera #1 3V3
- System 1V8
- FAN 5V
- (near R91) DNP
- (near R96) #MOD_SLEEP - fan off in sleep and shutdown
- #RESET - fan off only in shutdown
- (near R96) DNP
- Title:
- Size:
- Date:
- A3
- Revision:
- Page:
- of
- Antmicro Ltd.
- File:
- www.antmicro.com
- (in symbol 74HC00PW) 4xNAND

### Library data of the parts
C16-C18 = C_47u_0805: MLCC SMT Capacitor 47uF 0805; Manufacturer: KEMET; PartSymbol: C0805C476M9PACTU; PartNumber: C_47u_0805; Value: 47u
C19 C71 = C_100n_0402: as C9 on sheet csi; Value: 100n; PartNumber: C_100n_0402
C21-C23 = C_2u2_1206: MLCC SMT Capacitor 2.2uF 1206; Manufacturer: KEMET; PartSymbol: C1206C225J5RACTU; PartNumber: C_2u2_1206; Value: 2u2
C24 = C_10n_0402: MLCC SMT Capacitor 10 nF 0402; Manufacturer: AVX; PartSymbol: 04025G103ZAT2A; PartNumber: C_10n_0402; Value: 10n
C25 = C_4n7_0402: MLCC SMT Capacitor 4.7 nF 0402; Manufacturer: TDK; PartSymbol: CGA2B3X7S2A472K050BB; PartNumber: C_4n7_0402; Value: 4n7
C28 = C_1u_0402: MLCC SMT Capacitor 1uF 0402; Manufacturer: MULTICOMP; PartSymbol: MC0402F105Z6R3CT; PartNumber: C_1u_0402; Value: 1u
C41 = C_47n_0402: MLCC SMT Capacitor 47nF 0402; Manufacturer: MULTICOMP; PartSymbol: MC0402X473K160CT; PartNumber: C_47n_0402; Value: 47n
C55 C57 = C_4u7_0402: as C1 on sheet display; PartNumber: C_4u7_0402; Value: 4u7
C56 C58 C60 C63 = C_10u_0603: MLCC SMT Capacitor 10uF 0603; Manufacturer: Walsin; PartSymbol: 0603X106M6R3CT; Value: 10u; PartNumber: C_10u_0603
C59 C65 = C_2u2_0402: MLCC SMT Capacitor 2.2uF 0402; Manufacturer: TDK; PartSymbol: C1005X5R1A225K050BC; Value: 2u2; PartNumber: C_2u2_0402
C61 = C_100p_0402: MLCC SMT Capacitor 100pF 0402; Manufacturer: WALSIN; PartSymbol: 0402N101J500CT; PartNumber: C_100p_0402; Value: 100p
C64 = C_47p_0402: MLCC SMT Capacitor 47pF 0402; Manufacturer: KEMET; PartSymbol: C0402C470J5GACTU; PartNumber: C_47p_0402; Value: 47p
D1 = Diode Schottky: DIODE SCHOTTKY 60V 7A POWERDI5; Manufacturer: DIODES INC.; PartNumber: PDS760-13; Value: PDS760-13; PartSymbol: PDS760-13
D13 D14 = diode: as D2 on sheet display; PartNumber: 1N4148WS; Value: 1N4148WS; PartSymbol: 1N4148WS
FAN = molex_2223-2021: Pinhead connector with key; Manufacturer: Molex; PartSymbol: 022232021 A-6373-02A222; Value: MX-22-23-2021; PartNumber: molex_2223-2021
IC3 = TPS54561: IC REG BCK SPLIT RAIL ADJ 10WSON; Manufacturer: TEXAS INSTRUMENTS; PartNumber: TPS54561-Q1; Value: TPS54561-Q1; PartSymbol: TPS54561-Q1
IC4 = TLV700: Voltage Regulator, 2V to 5.5V, 175mV Dropout, 1.8Vout, 200mAout; Manufacturer: TEXAS INSTRUMENTS; Value: TLV70018DCKT; PartNumber: TLV70018DCKT; PartSymbol: TLV70018DCKT
IC8 IC9 = LM3671: DC/DC Buck Converter; Manufacturer: TEXAS INSTRUMENTS; PartSymbol: LM3671MF-3.3/NOPB; Value: LM3671MF-3.3; PartNumber: LM3671MF-3.3
IC10 = TPS62823: IC REG BUCK ADJ 1A 8VSON-HR; Manufacturer: TEXAS INSTRUMENTS; PartNumber: TPS62823; Value: TPS62823DLCT; PartSymbol: TPS62823DLCT; Class: IC
IC12 = 74HC00PW: 2 NAND Gate, 4 channel; Manufacturer: NEXPERIA; PartNumber: 74HC00PW; Value: 74HC00PW; PartSymbol: 74HC00PW
IC13 = SN74LVC1G126: Buffer, tri-state; Manufacturer: Texas Instruments; PartNumber: SN74LVC1G126DCKR; Value: SN74LVC1G126DCKR; PartSymbol: SN74LVC1G126DCKR
J4 = DC_SOCKET: DC Power Connector, Jack, 4 A, 1.95 mm, PCB Mount, Through Hole; Manufacturer: MULTICOMP; PartNumber: DC_SOCKET; PartSymbol: MJ-179PH; Value: MJ-179PH
L1 = WE_7447798720: Fixed Inductors WE-PDF 1064 7.2uH 7.9A 12.8mOhm; Manufacturer: WURTH ELEKTRONIK; PartNumber: WE_7447798720; Value: WE_7447798720; PartSymbol: 7447798720; Inductance: 7.2uH; RatedCurrent: 7.9A
L4 L6 = LQH32PN2R2NN0L: INDUCTOR, 2.2 ?H, ? 30%, 1212, 90 MHz, 0.073 ohm; Manufacturer: MURATA; Inductance: 2.2uH; PartNumber: LQH32PN2R2NN0L; Value: LQH32PN2R2NN0L; PartSymbol: LQH32PN2R2NN0L
L5 = IHLP1212AEERR47M11: FIXED IND 470NH 6.7A 15 MOHM SMD; Manufacturer: VISHAY; Class: Inductance; PartNumber: IHLP1212AEERR47M11; Value: IHLP1212AEERR47M11; PartSymbol: IHLP1212AEERR47M11; Inductance: 470nH; RatedCurrent: 6.7A
R16 R36 R87 = R_1k_0402: RES, 1k, 0402; Manufacturer: BOURNS; PartSymbol: CR0402-FX-1001GLF; PartNumber: R_1k_0402; Value: 1k
R44 R134 = R_243k_0402: RES, 243k, 0402; Manufacturer: MULTICOMP; PartSymbol: MCMR04X2433FTL; PartNumber: R_243k_0402; Value: 243k
R45 = R_49R9_0402: RES, 49R9, 0402; Manufacturer: VISHAY; PartSymbol: CRCW040249R9FKED; PartNumber: R_49R9_0402; Value: 49R9
R46 R135 = R_53k6_0402: RES, 53k6, 0402; Manufacturer: TE CONECTIVITY; PartSymbol: CPF0402B53K6E1; PartNumber: R_53k6_0402; Value: 53k6
R48 = R_16k9_0402: RES, 16k9, 0402; Manufacturer: Panasonic; PartSymbol: ERA2AEB1692X; PartNumber: R_16k9_0402; Value: 16k9
R52 = R_10k2_0402: RES, 10k2, 0402, 0.1%; PartNumber: R_10k2_0402_0.1%; Manufacturer: TE CONECTIVITY; PartSymbol: CPF0402B10K2E1; Value: 10k2; Tolerance: 0.1%
R74 = R_0R_0805: RES, 0R, 0805; Manufacturer: BOURNS; PartSymbol: CR0805-J/-000ELF; PartNumber: R_0R_0805; Value: 0R
R75 R89 R91 R92 R130 = R_0R_0402: as R13 on sheet csi; PartNumber: R_0R_0402; Value: 0R
R76 R90 R93-R96 = R_10k_0402: RES, 10k, 0402; Manufacturer: MULTICOMP; PartSymbol: MCMR04X1002FTL; Tolerance: 1%; PartNumber: R_10k_0402; Value: 10k
R77 = R_100k_0402: as R26 on sheet display; PartNumber: R_100k_0402; Value: 100k
R84 R86 = R_200k_0402: RES, 200k, 0402; Manufacturer: YAGEO; PartSymbol: RC0402FR-07200KL; PartNumber: R_200k_0402; Value: 200k
R85 = R_470k_0402: SMT Resistor 470k 0402; Manufacturer: VISHAY; PartSymbol: CRCW0402470KFKED; PartNumber: R_470k_0402; Value: 470k
T3 = NMOS: as T1 on sheet display; Value: BSS138PW; PartNumber: BSS138PW; PartSymbol: BSS138PW
TP5 TP16 TP17 TP40-TP45 TP47 = Testpad: Testpad, round, 1.5mm; PartNumber: TP-R-1.5

## Nets that join several sheets
1V8_SYS: display (C5.2 IC11.5 R81.1), supply (C28.2 IC4.5 TP47.1)
3V3_FFC1: csi (6 pins), supply (C58.2 IC9.4 L6.2 TP45.1)
3V3_FFC2: csi (6 pins), supply (C56.2 IC8.4 L4.2 TP43.1)
3V3_SYS: csi (5 pins), display (5 pins), supply (5 pins)
5V0_SYS: display (IC2.13 IC2.15 L9.1), supply (25 pins)
GND: csi (29 pins), display (40 pins), supply (38 pins)

## Assembly variants
Prototype: not fitted R23 R37 R42 R47 R54 R64 R66 R68 R71 R75 R77 R79 R87 R89 R91 R112 R121